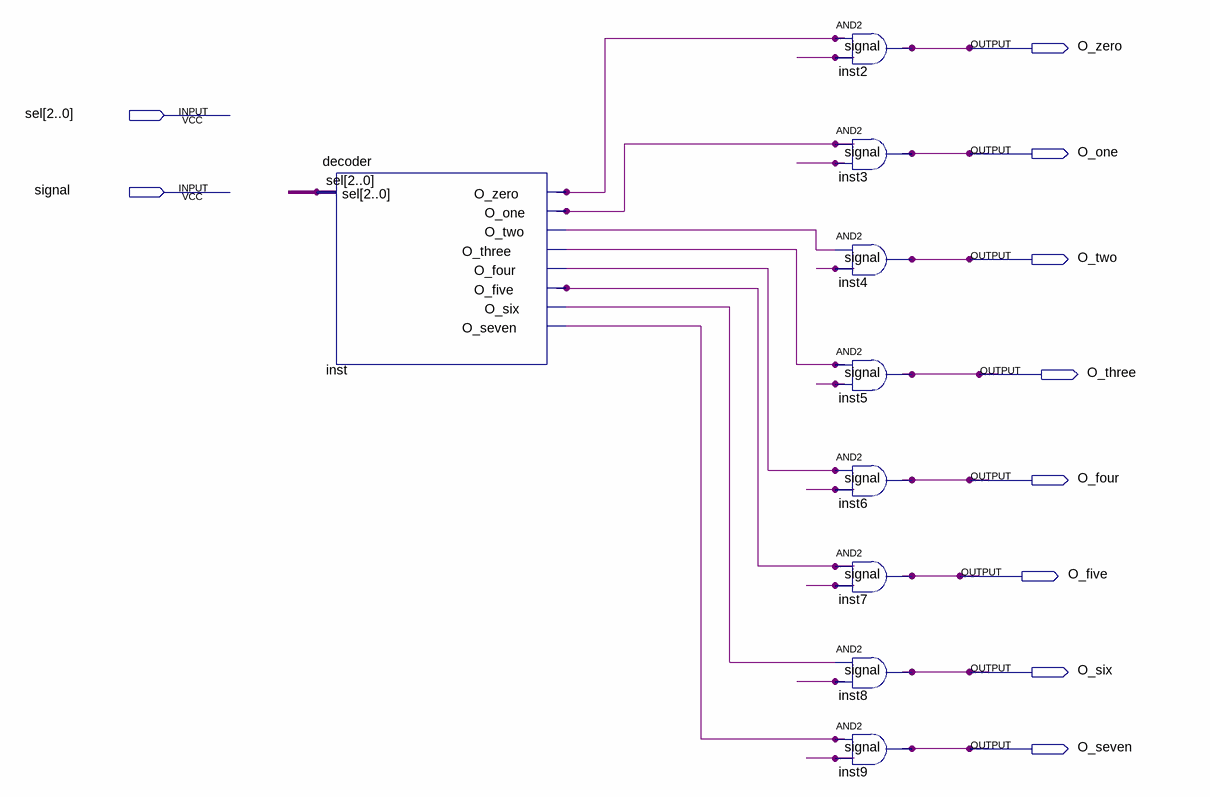
[diagram p0: schematic sheet]
// Quartus schematic signal_decoder.bdf as structural Verilog: 9 symbols, 10 pins
module signal_decoder (
  input  [2:0] sel,
  input  signal,
  output O_zero,
  output O_one,
  output O_two,
  output O_three,
  output O_four,
  output O_five,
  output O_six,
  output O_seven
);

  wire inst_o_five, inst_o_four, inst_o_one, inst_o_seven, inst_o_six, inst_o_three, inst_o_two, inst_o_zero;

  decoder inst (
    .sel(sel), .O_zero(inst_o_zero), .O_one(inst_o_one), .O_two(inst_o_two), .O_three(inst_o_three),
    .O_four(inst_o_four), .O_five(inst_o_five), .O_six(inst_o_six), .O_seven(inst_o_seven));
  and inst2 (O_zero, inst_o_zero, signal);
  and inst3 (O_one, inst_o_one, signal);
  and inst4 (O_two, inst_o_two, signal);
  and inst5 (O_three, inst_o_three, signal);
  and inst6 (O_four, inst_o_four, signal);
  and inst7 (O_five, inst_o_five, signal);
  and inst8 (O_six, inst_o_six, signal);
  and inst9 (O_seven, inst_o_seven, signal);
endmodule
